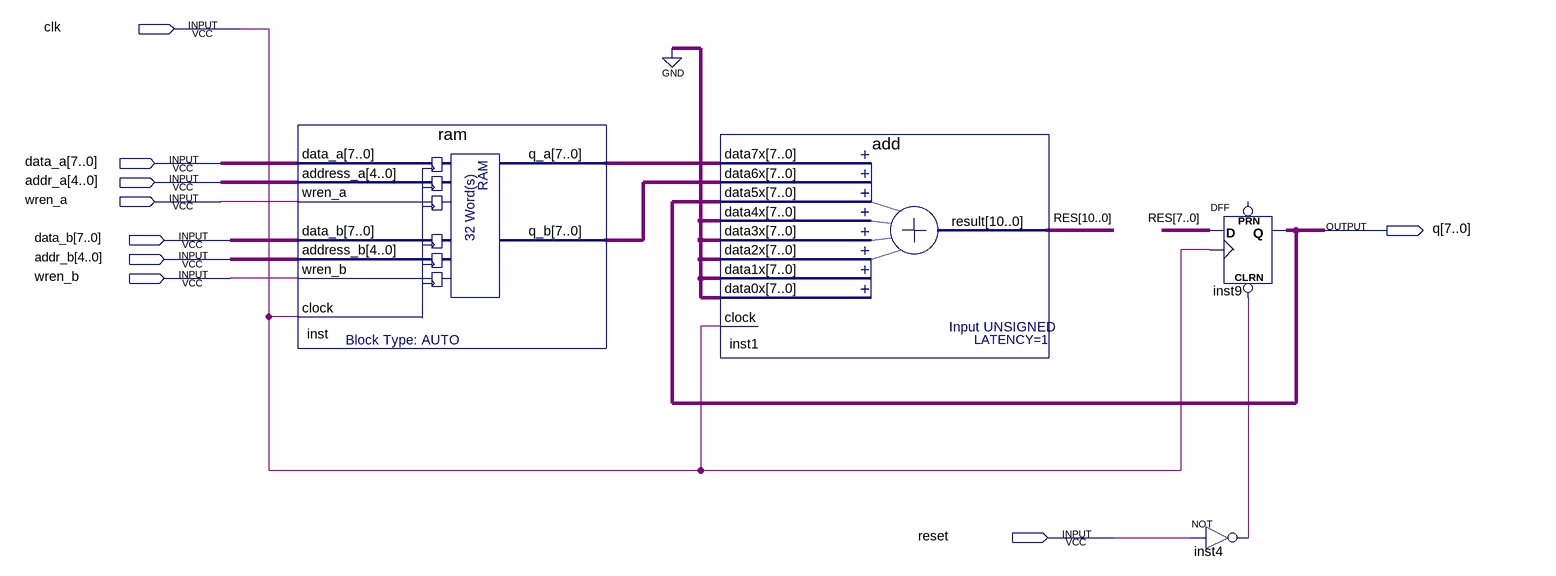
[diagram p0: schematic sheet]
// Quartus schematic adder.bdf as structural Verilog: 4 symbols, 9 pins
module adder (
  input  clk,
  input  [7:0] data_a,
  input  [4:0] addr_a,
  input  wren_a,
  input  [7:0] data_b,
  input  [4:0] addr_b,
  input  wren_b,
  input  reset,
  output [7:0] q
);

  wire inst4_out;
  wire [7:0] inst_q_a, inst_q_b;
  wire [10:0] RES;

  ram inst (
    .data_a(data_a), .address_a(addr_a), .wren_a(wren_a), .data_b(data_b), .address_b(addr_b),
    .wren_b(wren_b), .clock(clk), .q_a(inst_q_a), .q_b(inst_q_b));
  add inst1 (
    .data7x(inst_q_a), .data6x(inst_q_b), .data5x(q), .data4x({8{1'b0}}), .data3x({8{1'b0}}),
    .data2x({8{1'b0}}), .data1x({8{1'b0}}), .data0x({8{1'b0}}), .clock(clk), .result(RES));
  DFF inst9[7:0] (.CLRN(inst4_out), .CLK(clk), .D(RES[7:0]), .Q(q));  // open: PRN
  not inst4 (inst4_out, reset);
endmodule
